# Altium project BATT_ctrl2.PrjPcb
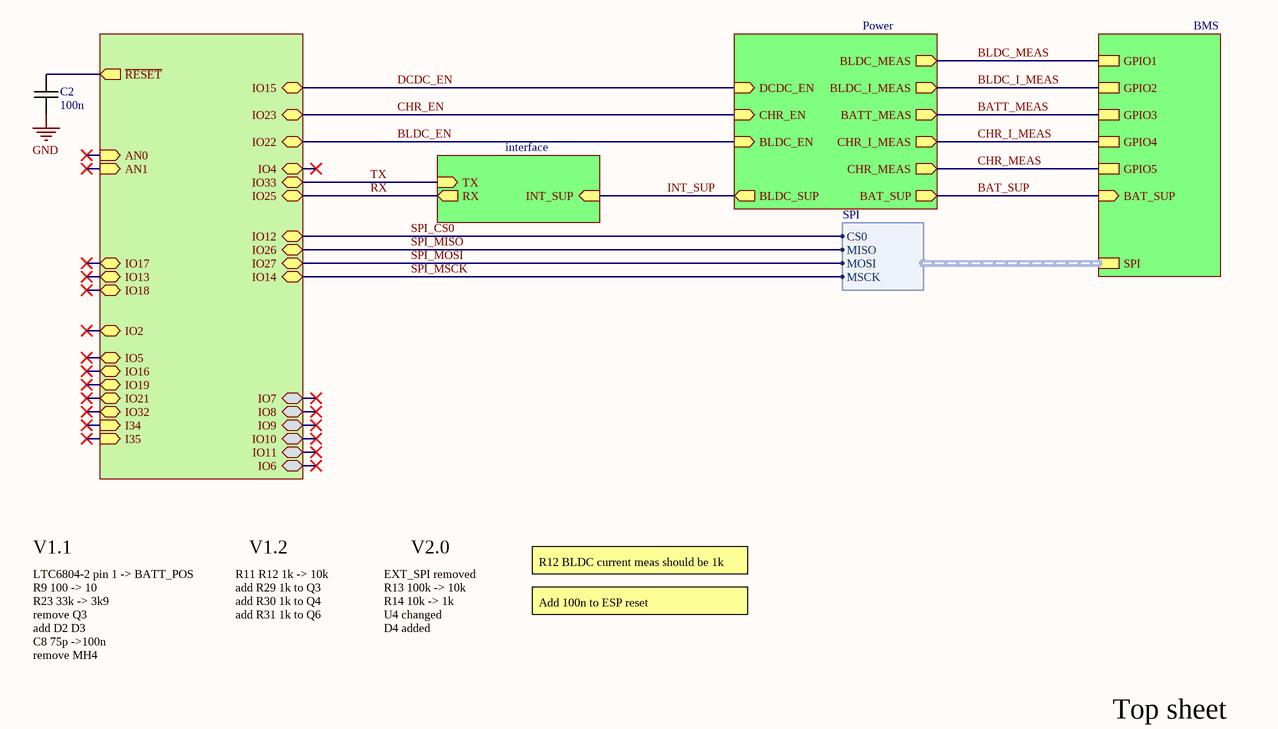
[diagram p0: top_sheet.SchDoc]
3 sheets, 60 parts. Net scope: hierarchical (ports join the sheet entries above them; power ports are global).
Board file: batt_ctrl_pcb_v2.PcbDoc
Sheets:
  top_sheet.SchDoc
    Power = power.SchDoc
    interface = data_interface.SchDoc

## Sheet top_sheet.SchDoc
size A4; SheetNumber: 1; SheetTotal: 5

### Parts
C2  100n  [CAPC0603(1608)55_N]

### Sub-sheets
BMS = LTC6804-2_BMS_TR.SchDoc (file not in this document): GPIO1, GPIO5, GPIO4, SPI (harness SPI), GPIO3, GPIO2, BAT_SUP (in)
interface = data_interface.SchDoc: TX (in), RX (out), INT_SUP (in)
Power = power.SchDoc: BLDC_EN (in), BLDC_I_MEAS (out), CHR_EN (in), CHR_I_MEAS (out), BLDC_MEAS (out), CHR_MEAS (out), BATT_MEAS (out), BAT_SUP (out), DCDC_EN (in), BLDC_SUP (out)
U_ESP32_WROOM2 = ESP32_WROOM2 (file not in this document): IO25 (bidir), IO26 (bidir), IO27 (bidir), IO22 (bidir), IO23 (bidir), IO32 (bidir), IO19 (bidir), IO21 (bidir), IO33 (bidir), IO14 (bidir), IO12 (bidir), IO15 (bidir), IO16 (bidir), IO17 (bidir), IO18 (bidir), IO13 (bidir), I34 (in), I35 (in), IO5 (bidir), IO4 (bidir), IO2 (bidir), AN0 (in), AN1 (in), IO7 (bidir), IO8 (bidir), IO9 (bidir), IO10 (bidir), IO11 (bidir), IO6 (bidir), ~{RESET} (out)

### Harnesses
SPI: CS0, MISO, MOSI, MSCK

### Nets
GND: C2.2
BAT_SUP: sheet BMS/BAT_SUP, sheet Power/BAT_SUP
BATT_MEAS: sheet BMS/GPIO3, sheet Power/BATT_MEAS
BLDC_EN: sheet U_ESP32_WROOM2/IO22, sheet Power/BLDC_EN
BLDC_I_MEAS: sheet BMS/GPIO2, sheet Power/BLDC_I_MEAS
BLDC_MEAS: sheet BMS/GPIO1, sheet Power/BLDC_MEAS
CHR_EN: sheet U_ESP32_WROOM2/IO23, sheet Power/CHR_EN
CHR_I_MEAS: sheet BMS/GPIO4, sheet Power/CHR_I_MEAS
CHR_MEAS: sheet BMS/GPIO5, sheet Power/CHR_MEAS
DCDC_EN: sheet U_ESP32_WROOM2/IO15, sheet Power/DCDC_EN
INT_SUP: sheet Power/BLDC_SUP, sheet interface/INT_SUP  [project net BLDC_POS]
RX: sheet U_ESP32_WROOM2/IO25, sheet interface/RX
SPI_CS0: sheet U_ESP32_WROOM2/IO12, sheet BMS/SPI.CS0
SPI_MISO: sheet U_ESP32_WROOM2/IO26, sheet BMS/SPI.MISO
SPI_MOSI: sheet U_ESP32_WROOM2/IO27, sheet BMS/SPI.MOSI
SPI_MSCK: sheet U_ESP32_WROOM2/IO14, sheet BMS/SPI.MSCK
TX: sheet U_ESP32_WROOM2/IO33, sheet interface/TX
NetC2_1: C2.1 ; sheet U_ESP32_WROOM2/~{RESET}

### Notes on the sheet
- V1.1
- LTC6804-2 pin 1 -> BATT_POS
- R11 R12 1k -> 10k
- V1.2
- EXT_SPI removed
- V2.0
- R12 BLDC current meas should be 1k
- R9 100 -> 10
- R23 33k -> 3k9
- remove Q3
- add D2 D3
- C8 75p ->100n
- add R29 1k to Q3
- add R30 1k to Q4
- add R31 1k to Q6
- R13 100k -> 10k
- R14 10k -> 1k
- U4 changed
- D4 added
- Add 100n to ESP reset
- remove MH4
- Top sheet

### Library data of the parts
C2 = Capacitor M: Ceramic capacitor Medium density; Value: 100n

## Sheet power.SchDoc
size A4; SheetNumber: 2; SheetTotal: 5
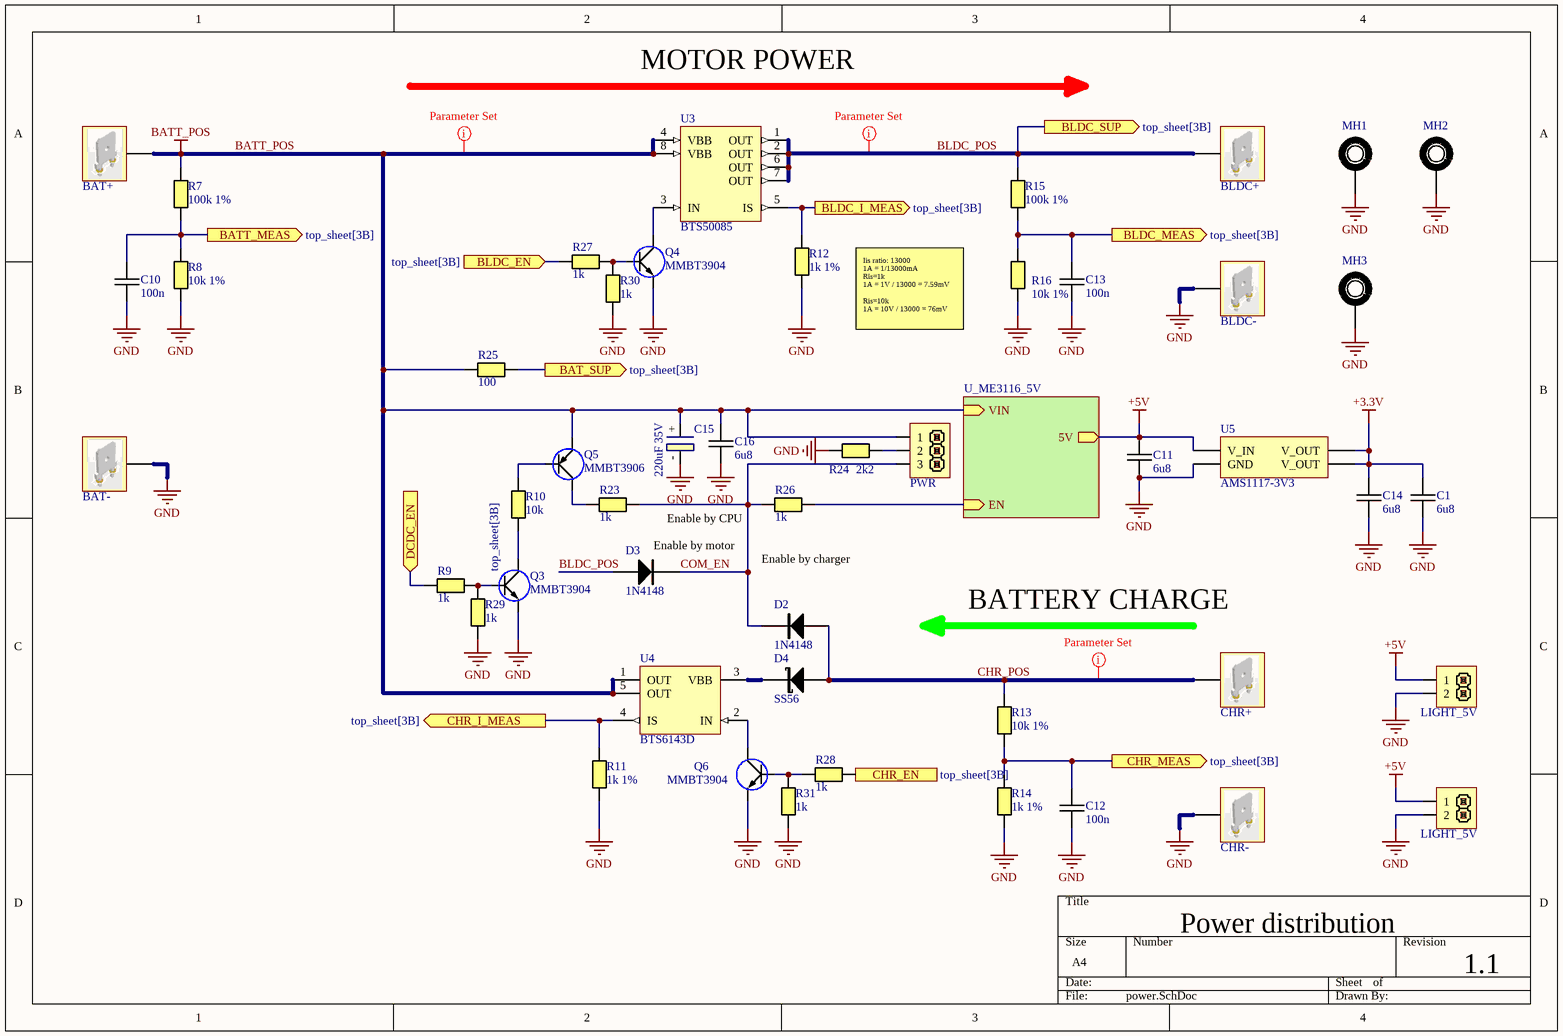
[diagram p1: power.SchDoc]

### Parts
BAT+  Crimp 6.3 single PCB  [Crimp 6.3mm single PCB]  (value not drawn)
BAT-  Crimp 6.3 single PCB  [Crimp 6.3mm single PCB]  (value not drawn)
BLDC+  Crimp 6.3 single PCB  [Crimp 6.3mm single PCB]  (value not drawn)
BLDC-  Crimp 6.3 single PCB  [Crimp 6.3mm single PCB]  (value not drawn)
C1  6u8  [CAPC0805(2012)75_N]
C10  100n  [CAPC0603(1608)55_N]
C11  6u8  [CAPC0805(2012)75_N]
C12  100n  [CAPC0603(1608)55_N]
C13  100n  [CAPC0603(1608)55_N]
C14  6u8  [CAPC0805(2012)75_N]
C15  220uF 35V  [10x10.5 Capacitor]
C16  6u8  [CAPC0805(2012)75_N]
CHR+  Crimp 6.3 single PCB  [Crimp 6.3mm single PCB]  (value not drawn)
CHR-  Crimp 6.3 single PCB  [Crimp 6.3mm single PCB]  (value not drawn)
CN1  PIN HEADER 1x2  [XH2.54 2P]  (value not drawn)
CN2  PIN HEADER 1x2  [XH2.54 2P]  (value not drawn)
D2  1N4148  [SOD80]
D3  1N4148  [SOD80]
D4  SS56  [SMAG]
MH1  Mounting Hole  [MH_M3]  (value not drawn)
MH2  Mounting Hole  [MH_M3]  (value not drawn)
MH3  Mounting Hole  [MH_M3]  (value not drawn)
PWR  PIN HEADER 1x3  [XH2.54 3P]  (value not drawn)
Q3  MMBT3904  [SOT23]
Q4  MMBT3904  [SOT23]
Q5  MMBT3906  [SOT23]
Q6  MMBT3904  [SOT23]
R7  100k 1%  [RESC0603(1608)_N]
R8  10k 1%  [RESC0603(1608)_N]
R9  1k  [RESC0603(1608)_N]
R10  10k  [RESC0603(1608)_N]
R11  1k 1%  [RESC0603(1608)_N]
R12  1k 1%  [RESC0603(1608)_N]
R13  10k 1%  [RESC0603(1608)_N]
R14  1k 1%  [RESC0603(1608)_N]
R15  100k 1%  [RESC0603(1608)_N]
R16  10k 1%  [RESC0603(1608)_N]
R23  1k  [RESC0603(1608)_N]
R24  2k2  [RESC0603(1608)_N]
R25  100  [RESC0603(1608)_N]
R26  1k  [RESC0603(1608)_N]
R27  1k  [RESC0603(1608)_N]
R28  1k  [RESC0603(1608)_N]
R29  1k  [RESC0603(1608)_N]
R30  1k  [RESC0603(1608)_N]
R31  1k  [RESC0603(1608)_N]
U3  BTS50085  [PG-TO220-7-4]
U4  BTS6143D  [ITO252-5-11_M]
U5  AMS1117-3V3  [SOT229P700X180-4N]

### Sub-sheets
U_ME3116_5V = ME3116_5V (file not in this document): EN (in), VIN (in), 5V (out)

### Ports
BAT_SUP (out, see top_sheet[3B]), BATT_MEAS (out, see top_sheet[3B]), BLDC_EN (in, see top_sheet[3B]), BLDC_I_MEAS (out, see top_sheet[3B]), BLDC_MEAS (out, see top_sheet[3B]), BLDC_SUP (out, see top_sheet[3B]), CHR_EN (in, see top_sheet[3B]), CHR_I_MEAS (out, see top_sheet[3B]), CHR_MEAS (out, see top_sheet[3B]), DCDC_EN (in, see top_sheet[3B])

### Nets
+3.3V: C1.1 C14.1 U5.2(V_OUT) U5.4(V_OUT)
+5V: C11.1 CN1.1 CN2.1 U5.3(V_IN) ; sheet U_ME3116_5V/5V
BATT_POS: BAT+.1 C15.+ C16.2 PWR.1 Q5.2(E) R7.2 R25.2 U3.4(VBB) U3.8(VBB) U4.1(OUT) U4.5(OUT) ; sheet U_ME3116_5V/VIN
GND: BAT-.1 BLDC-.1 C1.2 C10.2 C11.2 C12.2 C13.2 C14.2 C15.- C16.1 CHR-.1 CN1.2 CN2.2 MH1.1 MH2.1 MH3.1 Q3.2(E) Q4.2(E) Q6.2(E) R8.1 R11.1 R12.1 R14.1 R16.1 R24.2 R29.1 R30.1 R31.1 U5.1(GND)
BAT_SUP: R25.1 ; port BAT_SUP
BATT_MEAS: C10.1 R7.1 R8.2 ; port BATT_MEAS
BLDC_EN: R27.1 ; port BLDC_EN
BLDC_I_MEAS: R12.2 U3.5(IS) ; port BLDC_I_MEAS
BLDC_MEAS: C13.1 R15.1 R16.2 ; port BLDC_MEAS
BLDC_POS: BLDC+.1 D3.1(A) R15.2 U3.1(OUT) U3.2(OUT) U3.6(OUT) U3.7(OUT) ; port BLDC_SUP
CHR_EN: R28.1 ; port CHR_EN
CHR_I_MEAS: R11.2 U4.4(IS) ; port CHR_I_MEAS
CHR_MEAS: C12.1 R13.1 R14.2 ; port CHR_MEAS
CHR_POS: CHR+.1 D2.1(A) D4.2(A) R13.2
COM_EN: D2.2(K) D3.2(K) PWR.3 R23.1 R26.2
DCDC_EN: R9.1 ; port DCDC_EN
NetD4_1: D4.1(K) U4.3(VBB)
NetPWR_2: PWR.2 R24.1
NetQ3_1: Q3.1(B) R9.2 R29.2
NetQ3_3: Q3.3(C) R10.2
NetQ4_1: Q4.1(B) R27.2 R30.2
NetQ4_3: Q4.3(C) U3.3(IN)
NetQ5_1: Q5.1(B) R10.1
NetQ5_3: Q5.3(C) R23.2
NetQ6_1: Q6.1(B) R28.2 R31.2
NetQ6_3: Q6.3(C) U4.2(IN)
NetR26_1: R26.1 ; sheet U_ME3116_5V/EN

### Layout directives
net class Direct: BATT_POS, BLDC_POS, CHR_POS

### Notes on the sheet
- MOTOR POWER
- Iis ratio: 13000
  1A = 1/13000mA
  Ris=1k
  1A = 1V / 13000 = 7.59mV
  Ris=10k
  1A = 10V / 13000 = 76mV
- Enable by CPU
- (near D3) Enable by motor
- Enable by charger
- BATTERY CHARGE
- Power distribution
- 1.1

### Library data of the parts
BAT+ BAT- BLDC+ BLDC- CHR+ CHR- = Crimp 6.3 single PCB: Straight Mount Angle PCB Tab Terminal
  BAT- BLDC- CHR-: ClassName: DirectGND
C1 C10-C14 C16 = Capacitor M: Ceramic capacitor Medium density
  C1 C11 C14 C16: Value: 6u8
  C10 C12 C13: Value: 100n
C15 = Capacitor Electrolitic: Value: 220uF 35V
CN1 CN2 = PIN HEADER 2.54 1x2: LIGHT_5V; Parameter 1: LIGHT_5V
D2 D3 = 1N4148: Small Signal Fast Switching Diodes; Repetitive peak reverse voltage: 100 V; Reverse voltage: 75 V; Peak forward surge current: 2 A; Repetitive peak forward current: 500 mA; Forward continuous current: 300 mA; Average forward current: 150 mA; Diode capacitance: 4 pF; Reverse recovery time: 4 ~ 8 ns; Supplier 1: Mouser; Supplier Part Number 1: 78-MCL4148
D4 = SS56: Surface Mount Schottky Barrier Rectifier; If (av): 5.0A; Vrrm: 42V; Ifsm: 150A
PWR = PIN HEADER 2.54 1x3
Q3 Q4 Q6 = 2N3904: NPN General Purpose Transistor; Collector-Emitter Voltage: 40V; Collector-Base Voltage: 60V; Collector Current - Continuous: 200mA; DC Current Gain: 300
Q5 = 2N3906: PNP General Purpose Transistor; Collector-Emitter Voltage: -40V; Collector-Base Voltage: -60V; Collector Current - Continuous: 200mA; DC Current Gain: 300
R7-R16 R23-R31 = Resistor M: Resistor Medium Density
  R7 R15: Value: 100k 1%
  R8 R13 R16: Value: 10k 1%
  R9 R23 R26-R31: Value: 1k
  R10: Value: 10k
  R11 R12 R14: Value: 1k 1%
  R24: Value: 2k2
  R25: Value: 100
U3 = BTS50085-1TMA: Smart Highside High Current Power Switch; Overvoltage protection: 70V; Output clamp: 62V; Operating voltage: 5.0 .. 58V; On-state resistance: 9 mOhm; Load current (ISO): 44A; Short circuit current limitation: 90A; Current sense ratio: 13000
U4 = BTS6143D: PROFET Smart Highside Power Switch, 1 Channel, 10 A Load Current, -40 to 150 degC, PG-TO252-5-11, Reel, Green; Manufacturer: Infineon; Recommended Operating Voltage Min.: 5.5 V; RON(max) @ 150degreesC: 18 mOhm; toff (max): 500 us; Load Current (typ): 10 A; RON @ 25degreesC: 10 mOhm; Recommended Operating Voltage Max.: 38 V; Green: TRUE; Ptot (max): 59 W; Group: Automotive Qualified; Channels: 1; Packing: Reel; ComponentLink1URL: http://www.infineon.com/; PartNumber: BTS6143D; Mounting Technology: Surface Mount; ComponentLink2Description: Datasheet; ComponentLink3URL: http://www.infineon.com/dgdl/TLE7276-Data+Sheet-+v1_11.pdf?folderId=db3a304412b407950112b408e8c90004&fileId=db3a304412b407950112b436c53f66c8&sId=db3a30433db6f09f013dc0e43c0428c1; ComponentLink3Description: Package Specification; ComponentLink2URL: http://www.infineon.com/dgdl/BTS6143D_DS_v10.pdf?folderId=db3a304314dca389011537739e37155f&fileId=db3a3043183a95550118606a2705368e&location=en.Products.Automotive_ICs.Smart_High-_and_Low-Side_Switches.PROFET__-_Smart_High_Side_Switches.DATASHEET.BTS6143D_D; ComponentLink1Description: Manufacturer URL; PackageVersion: Nov-10; PackageDescription: 5-Pin Plastic (Green) Transistor Single Outline Package, 6.5 x 6.12 mm Body, 1.14 mm Pitch; Halogen-free: TRUE; DatasheetVersion: Rev. 1.0; PackageReference: PG-TO252-5-11; ton (max): 500 us
U5 = AMS1117: 800mA LDO  15V max
MH1-MH3 = Mounting Hole: ClassName: DirectGND

## Sheet data_interface.SchDoc
size A4; SheetNumber: 5; SheetTotal: 6
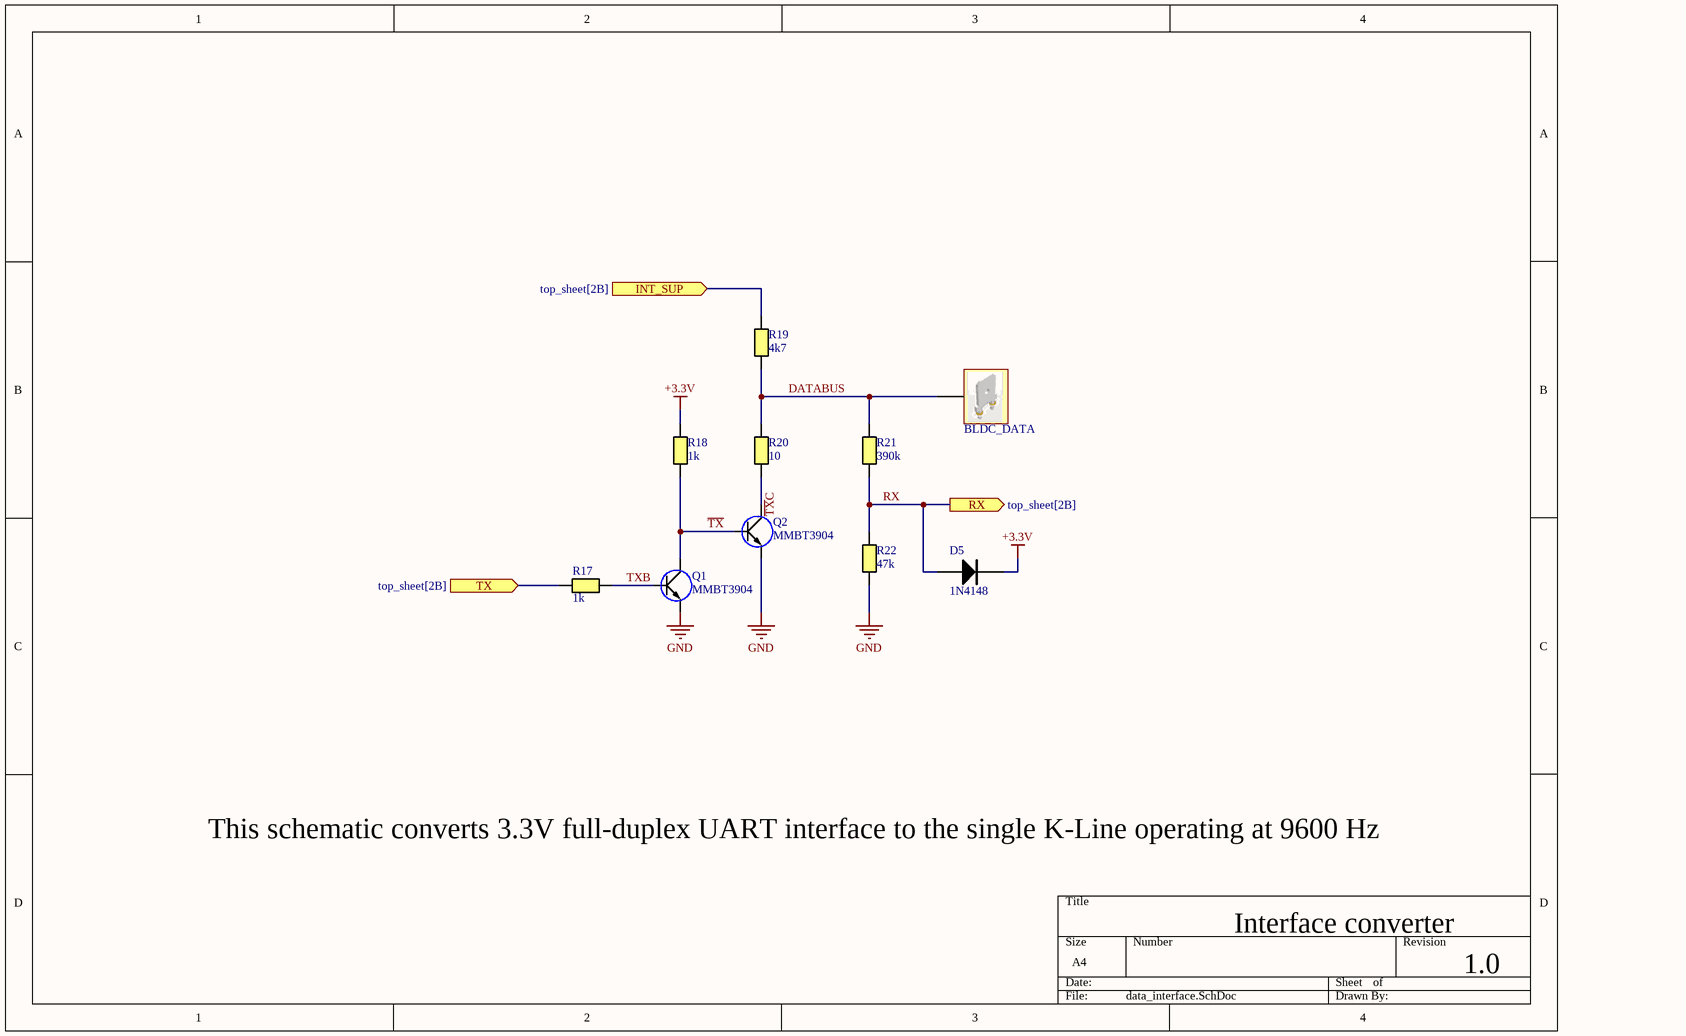
[diagram p2: data_interface.SchDoc]

### Parts
BLDC_DATA  Crimp 6.3 single PCB  [Crimp 6.3mm single PCB]  (value not drawn)
D5  1N4148  [SOD80]
Q1  MMBT3904  [SOT23]
Q2  MMBT3904  [SOT23]
R17  1k  [RESC0603(1608)_N]
R18  1k  [RESC0603(1608)_N]
R19  4k7  [RESC0603(1608)_N]
R20  10  [RESC0603(1608)_N]
R21  390k  [RESC0603(1608)_N]
R22  47k  [RESC0603(1608)_N]

### Ports
INT_SUP (in, see top_sheet[2B]), RX (out, see top_sheet[2B]), TX (in, see top_sheet[2B])

### Nets
+3.3V: D5.2(K) R18.2
GND: Q1.2(E) Q2.2(E) R22.1
BLDC_POS: R19.2 ; port INT_SUP
DATABUS: BLDC_DATA.1 R19.1 R20.2 R21.2
RX: D5.1(A) R21.1 R22.2 ; port RX
~{TX}: Q1.3(C) Q2.1(B) R18.1
~{TX}C: Q2.3(C) R20.1
TX: R17.1 ; port TX
TXB: Q1.1(B) R17.2

### Notes on the sheet
- This schematic converts 3.3V full-duplex UART interface to the single K-Line operating at 9600 Hz
- Interface converter
- 1.0

### Library data of the parts
BLDC_DATA = Crimp 6.3 single PCB: Straight Mount Angle PCB Tab Terminal
D5 = 1N4148: as D2 on sheet power; Supplier 1: Mouser; Supplier Part Number 1: 78-MCL4148
Q1 Q2 = 2N3904: as Q3 on sheet power
R17-R22 = Resistor M: Resistor Medium Density
  R17 R18: Value: 1k
  R19: Value: 4k7
  R20: Value: 10
  R21: Value: 390k
  R22: Value: 47k

## Nets that join several sheets
+3.3V: power (C1.1 C14.1 U5.2 U5.4), data_interface (D5.2 R18.2)
GND: top_sheet (C2.2), power (29 pins), data_interface (Q1.2 Q2.2 R22.1)
BLDC_POS: power (7 pins), data_interface (R19.2)